# Altium schematic sheet MT6816_Angle_Encoder.SchDoc
size A4; SheetNumber: 1; SheetTotal: 1
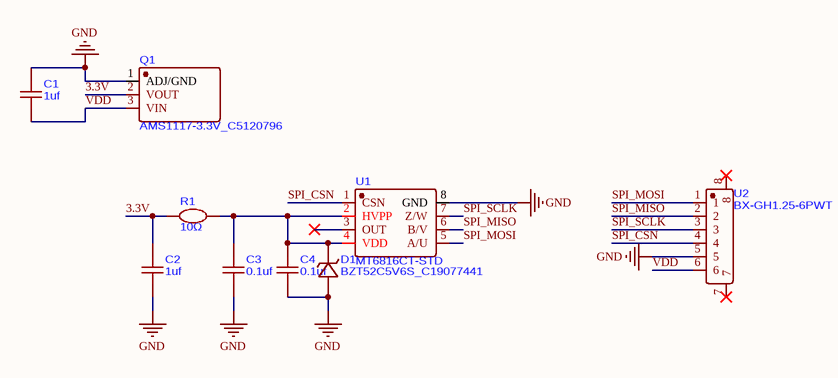
[diagram p0: MT6816_Angle_Encoder.SchDoc]

## Parts
C1  1uf  [C0402]
C2  1uf  [C0402]
C3  0.1uf  [C0402]
C4  0.1uf  [C0402]
D1  BZT52C5V6S_C19077441  [SOD-323_L1.7-W1.3-LS2.6-RD]
Q1  AMS1117-3.3V_C5120796  [SOT-89-3_L4.5-W2.5-P1.50-LS4.2-BR]
R1  10Ω  [R0402]
U1  MT6816CT-STD  [SOP-8_L4.9-W3.9-P1.27-LS6.0-BL]
U2  BX-GH1.25-6PWT  [CONN-SMD_6P-P1.25_BX-GH1.25-6PWT]

## Nets
GND: C1.2 C2.1 C3.1 C4.1 D1.2(A) Q1.1(ADJ/GND) U1.8(GND) U2.5
3.3V: C2.2 Q1.2(VOUT) R1.2
SPI_CSN: U1.1(CSN) U2.4
SPI_MISO: U1.6(B/V) U2.2
SPI_MOSI: U1.5(A/U) U2.1
SPI_SCLK: U1.7(Z/W) U2.3
VDD: C1.1 Q1.3(VIN) U2.6
NetC3_2: C3.2 C4.2 D1.1(K) R1.1 U1.2(HVPP) U1.4(VDD)

Not connected (* = marked no-connect by the designer): U1 3(OUT)*; U2 7* 8*

## Library data of the parts
C1-C4 = CC0402KRX6S5BB225
R1 = PTFR0402B30K0P9